# Altium project ConverterModule12V18A.PrjPcb
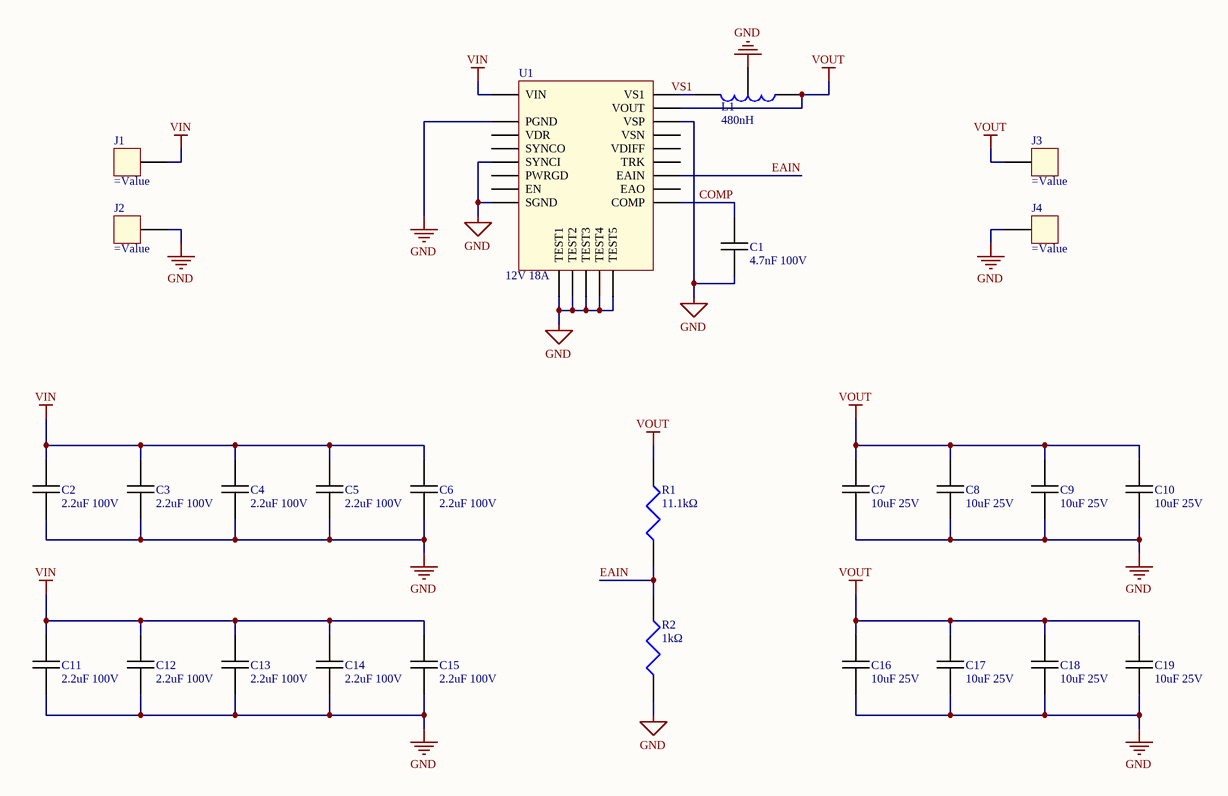
[diagram p0: ConverterModule12V18A.SchDoc]
1 sheet, 27 parts. Net scope: global (net labels, ports and power ports of the same name join across sheets).
Board file: ConverterModule12V18A.PcbDoc

## Sheet ConverterModule12V18A.SchDoc
size Letter; Organization: Colorado School of Mines; Address1: 1500 Illinois St.; Address2: Golden; Address3: CO 80401; Address4: USA; SheetNumber: 2; SheetTotal: 2

### Parts
C1  4.7nF 100V  [C1608 Generic]
C2  2.2uF 100V  [HMK325B7225MM-P]
C3  2.2uF 100V  [HMK325B7225MM-P]
C4  2.2uF 100V  [HMK325B7225MM-P]
C5  2.2uF 100V  [HMK325B7225MM-P]
C6  2.2uF 100V  [HMK325B7225MM-P]
C7  10uF 25V  [C1210C106M3RACTU]
C8  10uF 25V  [C1210C106M3RACTU]
C9  10uF 25V  [C1210C106M3RACTU]
C10  10uF 25V  [C1210C106M3RACTU]
C11  2.2uF 100V  [HMK325B7225MM-P]
C12  2.2uF 100V  [HMK325B7225MM-P]
C13  2.2uF 100V  [HMK325B7225MM-P]
C14  2.2uF 100V  [HMK325B7225MM-P]
C15  2.2uF 100V  [HMK325B7225MM-P]
C16  10uF 25V  [C1210C106M3RACTU]
C17  10uF 25V  [C1210C106M3RACTU]
C18  10uF 25V  [C1210C106M3RACTU]
C19  10uF 25V  [C1210C106M3RACTU]
J1  (no value)  [M3-Bolt-Down]
J2  (no value)  [M3-Bolt-Down]
J3  (no value)  [M3-Bolt-Down]
J4  (no value)  [M3-Bolt-Down]
L1  480nH  [PA5120.481NLT]
R1  11.1kΩ  [RNCF0603 Generic]
R2  1kΩ  [RNCF0603 Generic]
U1  12V 18A  [PI3526-00-LGIZ]

### Nets
GND: C1.2 C2.2 C3.2 C4.2 C5.2 C6.2 C7.1 C8.1 C9.1 C10.1 C11.2 C12.2 C13.2 C14.2 C15.2 C16.1 C17.1 C18.1 C19.1 J2.1 J4.1 L1.3 R2.1 U1.A5(VSP) U1.BLOCK2(PGND) U1.BLOCK5(SGND) U1.E1(TEST5) U1.H1(TEST4) U1.J1(TEST3) U1.K1(TEST2) U1.K2(TEST1) U1.K4(SYNCI)
VIN: C2.1 C3.1 C4.1 C5.1 C6.1 C11.1 C12.1 C13.1 C14.1 C15.1 J1.1 U1.BLOCK3(VIN)
VOUT: C7.2 C8.2 C9.2 C10.2 C16.2 C17.2 C18.2 C19.2 J3.1 L1.1 R1.1 U1.BLOCK4(VOUT)
COMP: C1.1 U1.B1(COMP)
EAIN: R1.2 R2.2 U1.A2(EAIN)
VS1: L1.2 U1.BLOCK1(VS1)

Not connected (* = marked no-connect by the designer): U1 A1(EAO) A3(VDIFF) A4(VSN) C1(TRK) F1(EN) G1(PWRGD) K3(SYNCO) K5(VDR)

### Notes on the sheet
- Title
- Size:
- Date:
- Letter
- Number:
- Time:
- Revision:
- Sheet
- of
- File:

### Library data of the parts
C1 = C1608C0G2A472J080AC: TDK CAP CER 4700PF 100V C0G 0603; Manufacturer: TDK Corporation; Part Number: C1608C0G2A472J080AC; Value: 4.7nF 100V; ComponentLink1Description: DigiKey; ComponentLink1URL: https://www.digikey.com/en/products/detail/tdk-corporation/C1608C0G2A472J080AC/5023335
C2-C6 C11-C15 = HMK325B7225MM-P: Taiyo Yuden CAP CER 2.2UF 100V X7R 1210; Part Number: HMK325B7225MM-P; Manufacturer: Taiyo Yuden; Value: 2.2uF 100V; ComponentLink1Description: DigiKey; ComponentLink1URL: https://www.digikey.com/en/products/detail/taiyo-yuden/HMK325B7225MM-P/7065949
C7-C10 C16-C19 = C1210C106M3RACTU: KEMET CAP CER 10UF 25V X7R 1210; Part Number: C1210C106M3RACTU; Manufacturer: KEMET; Value: 10uF 25V; ComponentLink1Description: DigiKey; ComponentLink1URL: https://www.digikey.com/en/products/detail/kemet/C1210C106M3RACTU/2216507
J1-J4 = M3-Bolt-Down: Generic bolt-down mount w/exposed copper pad
L1 = PA5120.481NLT: Pulse FIXED IND 480NH 32A 1.7MOHM SMD; Manufacturer: Pulse Electronics Power; Part Number: PA5120.481NLT; Value: 480nH; ComponentLink1Description: DigiKey; ComponentLink1URL: https://www.digikey.com/en/products/detail/pulse-electronics-power/PA5120-481NLT/13236345
R1 = RNCF0603BTE11K1: Stackpole RES 11.1K OHM 0.1% 1/10W 0603; Manufacturer: Stackpole Electronics Inc; Part Number: RNCF0603BTE11K1; Value: 11.1kΩ; ComponentLink1Description: DigiKey; ComponentLink1URL: https://www.digikey.com/en/products/detail/stackpole-electronics-inc/RNCF0603BTE11K1/3198128
R2 = RNCF0603TKY1K00: Stackpole RES 1K OHM 0.01% 1/10W 0603; Manufacturer: Stackpole Electronics Inc; Part Number: RNCF0603TKY1K00; Value: 1kΩ; ComponentLink1Description: DigiKey; ComponentLink1URL: https://www.digikey.com/en/products/detail/stackpole-electronics-inc/RNCF0603TKY1K00/2269697
U1 = PI3526-00-LGIZ: Vicor DC DC CONVERTER 12V 18A; Manufacturer: Vicor Corporation; Part Number: PI3526-00-LGIZ; Value: 12V 18A; ComponentLink1Description: DigiKey; ComponentLink1URL: https://www.digikey.com/en/products/detail/vicor-corporation/PI3526-00-LGIZ/7319725; ComponentLink2Description: Datasheet; ComponentLink2URL: http://www.vicorpower.com/documents/datasheets/ds_PI352x-00.pdf